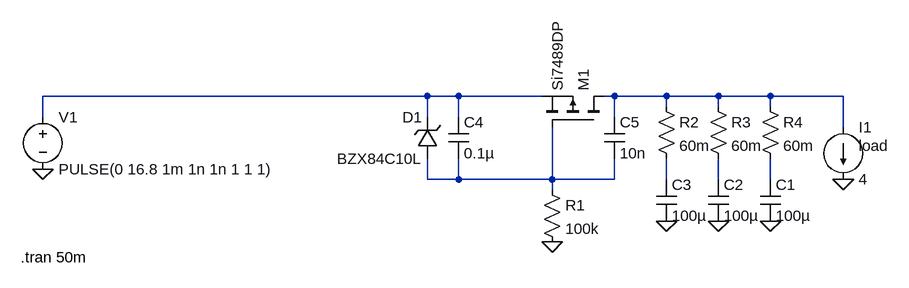
[diagram p0: schematic ITP_Inrush.asc]
ITP_Inrush.asc, the LTspice schematic file:
Version 4
SHEET 1 880 680
WIRE -48 -224 -640 -224
WIRE 0 -224 -48 -224
WIRE 128 -224 0 -224
WIRE 240 -224 224 -224
WIRE 320 -224 240 -224
WIRE 400 -224 320 -224
WIRE 480 -224 400 -224
WIRE 592 -224 480 -224
WIRE 320 -208 320 -224
WIRE 400 -208 400 -224
WIRE 480 -208 480 -224
WIRE -640 -192 -640 -224
WIRE -48 -192 -48 -224
WIRE 0 -192 0 -224
WIRE 240 -192 240 -224
WIRE 592 -176 592 -224
WIRE -48 -96 -48 -128
WIRE 0 -96 0 -128
WIRE 0 -96 -48 -96
WIRE 144 -96 144 -176
WIRE 144 -96 0 -96
WIRE 240 -96 240 -128
WIRE 240 -96 144 -96
WIRE 320 -96 320 -128
WIRE 400 -96 400 -128
WIRE 480 -96 480 -128
WIRE 144 -80 144 -96
FLAG 480 -32 0
FLAG 592 -96 0
FLAG -640 -112 0
FLAG 144 0 0
FLAG 400 -32 0
FLAG 320 -32 0
SYMBOL pmos 224 -176 M270
SYMATTR InstName M1
SYMATTR Value Si7489DP
SYMBOL voltage -640 -208 R0
WINDOW 123 0 0 Left 0
WINDOW 39 0 0 Left 0
SYMATTR InstName V1
SYMATTR Value PULSE(0 16.8 1m 1n 1n 1 1 1)
SYMBOL cap 464 -96 R0
SYMATTR InstName C1
SYMATTR Value 100µ
SYMBOL current 592 -176 R0
WINDOW 123 0 0 Left 0
WINDOW 39 24 28 Left 2
SYMATTR InstName I1
SYMATTR Value 4
SYMATTR SpiceLine load
SYMBOL res 128 -96 R0
SYMATTR InstName R1
SYMATTR Value 100k
SYMBOL zener -32 -128 R180
WINDOW 0 24 64 Left 2
WINDOW 3 24 0 Left 2
SYMATTR InstName D1
SYMATTR Value BZX84C10L
SYMATTR Description Diode
SYMATTR Type diode
SYMBOL cap 384 -96 R0
SYMATTR InstName C2
SYMATTR Value 100µ
SYMBOL cap 304 -96 R0
SYMATTR InstName C3
SYMATTR Value 100µ
SYMBOL cap -16 -192 R0
SYMATTR InstName C4
SYMATTR Value 0.1µ
SYMBOL cap 224 -192 R0
SYMATTR InstName C5
SYMATTR Value 10n
SYMBOL res 304 -224 R0
SYMATTR InstName R2
SYMATTR Value 60m
SYMBOL res 384 -224 R0
SYMATTR InstName R3
SYMATTR Value 60m
SYMBOL res 464 -224 R0
SYMATTR InstName R4
SYMATTR Value 60m
TEXT -674 24 Left 2 !.tran 50m

The netlist it stands for:
* ITP_Inrush.asc
M1 N002 N003 N001 N001 Si7489DP
V1 N001 0 PULSE(0 16.8 1m 1n 1n 1 1 1)
C1 N006 0 100µ
I1 N002 0 4 load
R1 N003 0 100k
D1 N003 N001 BZX84C10L
C2 N005 0 100µ
C3 N004 0 100µ
C4 N001 N003 0.1µ
C5 N002 N003 10n
R2 N002 N004 60m
R3 N002 N005 60m
R4 N002 N006 60m
.model D D
.lib standard.dio
.model NMOS NMOS
.model PMOS PMOS
.lib standard.mos
.tran 50m
.backanno
.end